# Altium schematic sheet 452006257#BDU控制板4-通讯接口.SchDoc
size A3; SheetNumber: 10; SheetTotal: 12
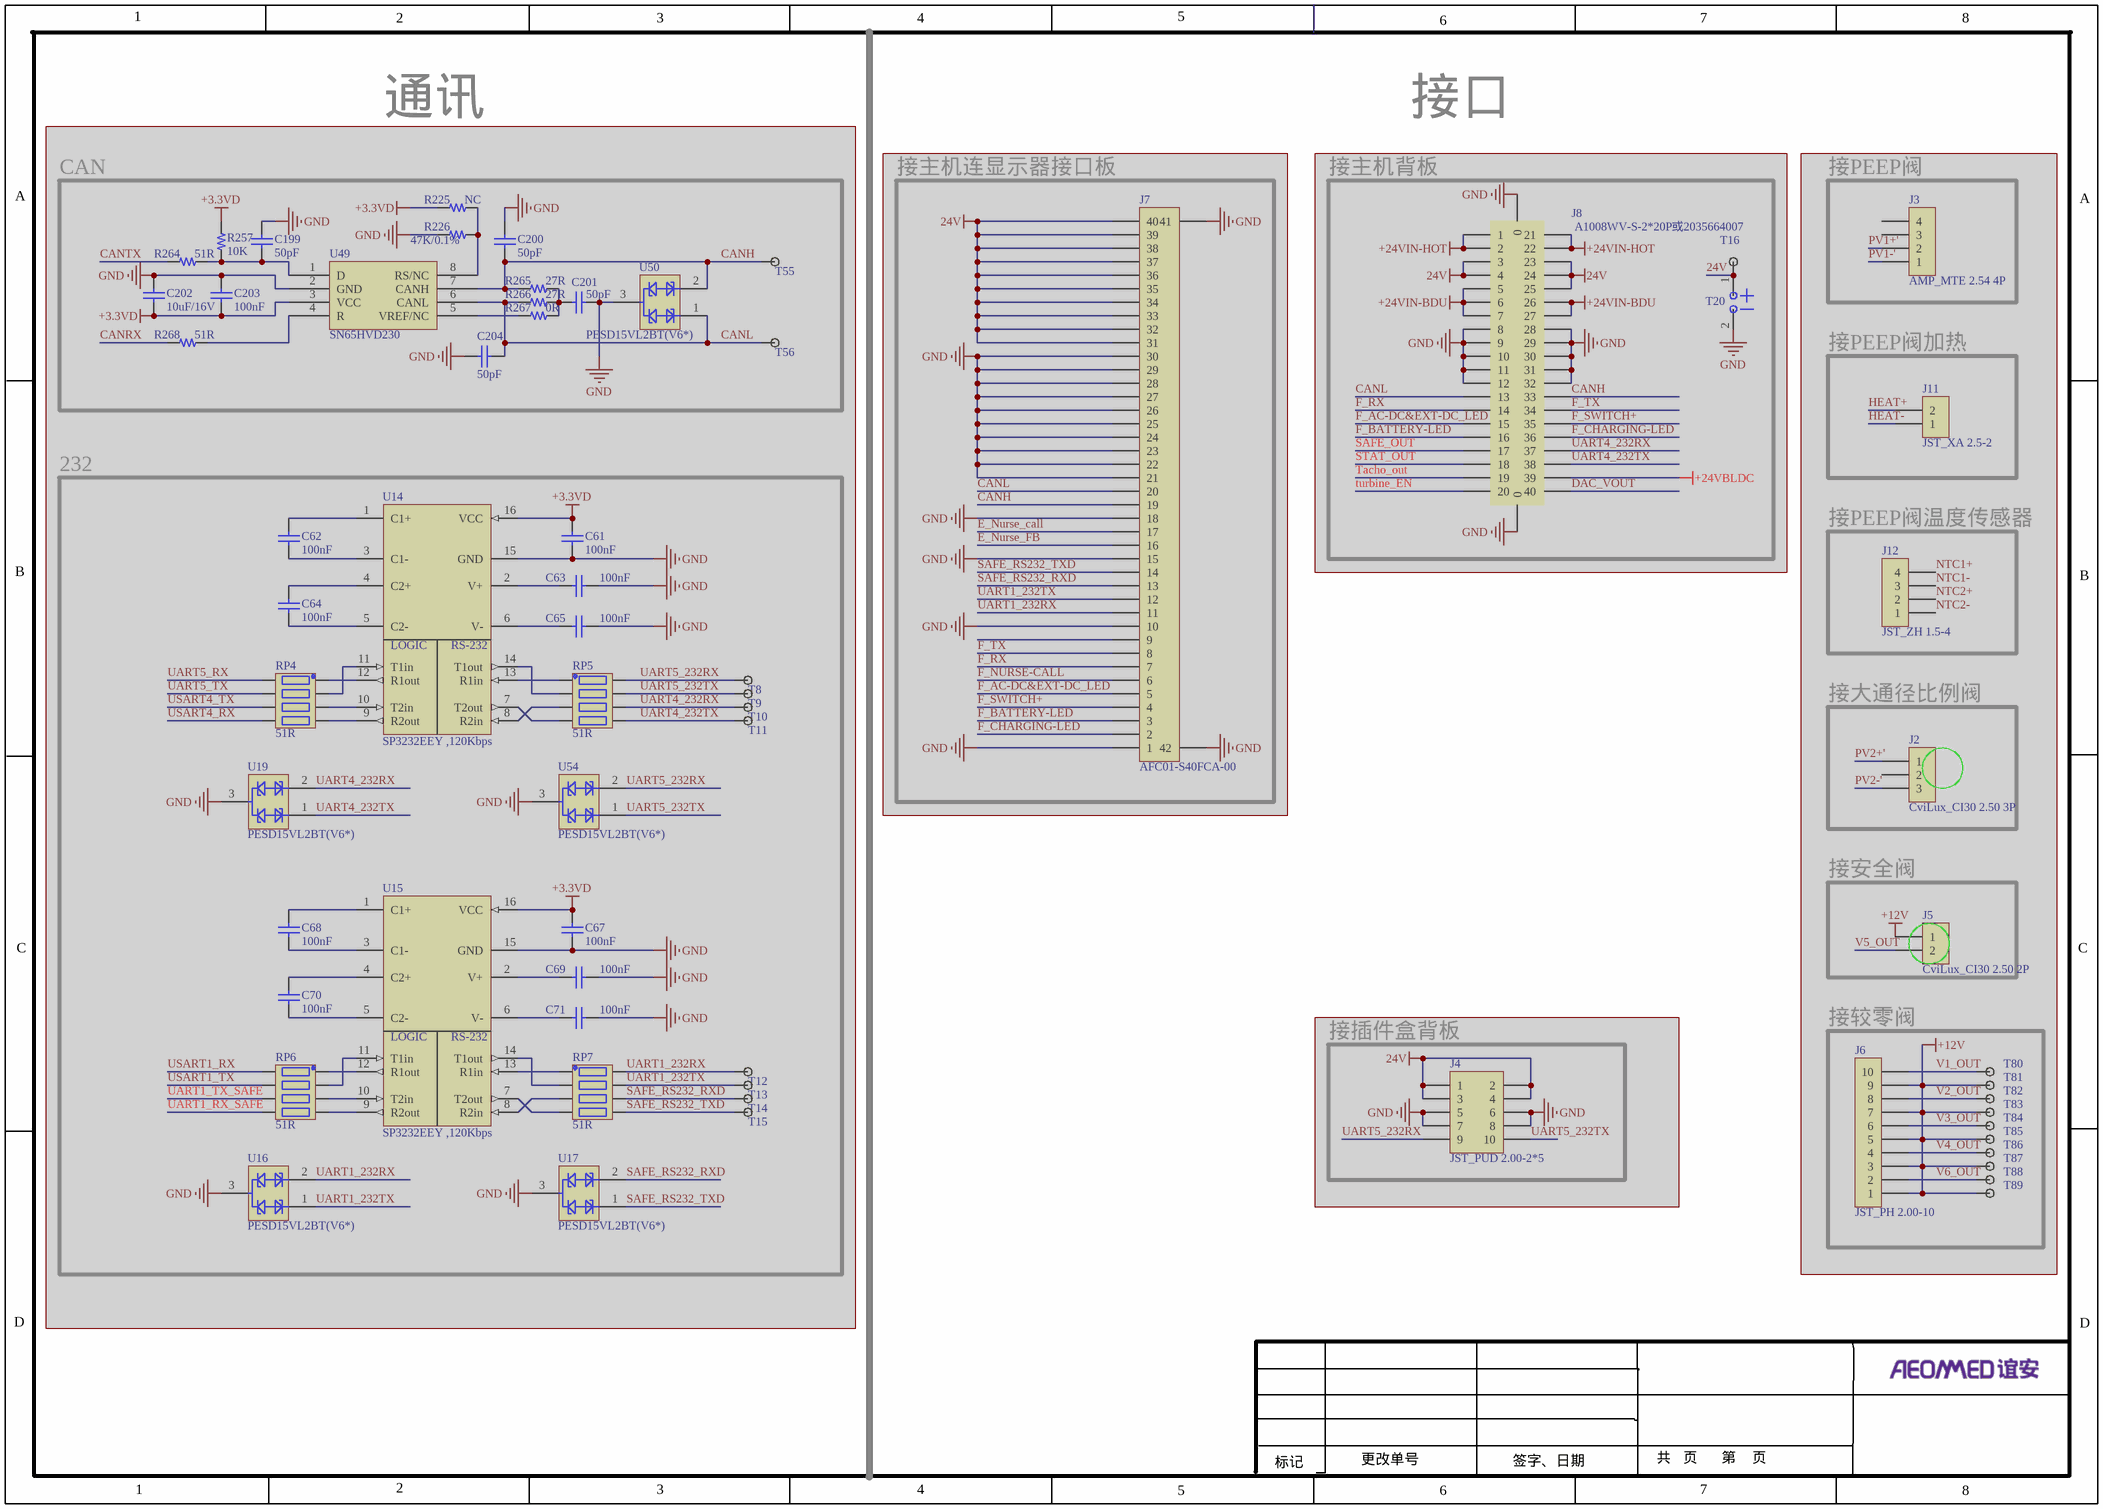
[diagram p0: 452006257#BDU控制板4-通讯接口.SchDoc]

## Parts
C61  100nF  [C-0603]  (masked out: inside a compile mask, not in the netlist)
C62  100nF  [C-0603]  (masked out: inside a compile mask, not in the netlist)
C63  100nF  [C-0603]  (masked out: inside a compile mask, not in the netlist)
C64  100nF  [C-0603]  (masked out: inside a compile mask, not in the netlist)
C65  100nF  [C-0603]  (masked out: inside a compile mask, not in the netlist)
C67  100nF  [C-0603]  (masked out: inside a compile mask, not in the netlist)
C68  100nF  [C-0603]  (masked out: inside a compile mask, not in the netlist)
C69  100nF  [C-0603]  (masked out: inside a compile mask, not in the netlist)
C70  100nF  [C-0603]  (masked out: inside a compile mask, not in the netlist)
C71  100nF  [C-0603]  (masked out: inside a compile mask, not in the netlist)
C199  50pF  [C-0603]  (masked out: inside a compile mask, not in the netlist)
C200  50pF  [C-0603]  (masked out: inside a compile mask, not in the netlist)
C201  50pF  [C-0603]  (masked out: inside a compile mask, not in the netlist)
C202  10uF/16V  [C-0805]  (masked out: inside a compile mask, not in the netlist)
C203  100nF  [C-0603]  (masked out: inside a compile mask, not in the netlist)
C204  50pF  [C-0603]  (masked out: inside a compile mask, not in the netlist)
J2  CviLux_CI30 2.50 3P  [CviLux_CI30 2.50 3P]  (masked out: inside a compile mask, not in the netlist)
J3  AMP_MTE 2.54 4P  [AMP_MTE 2.54 4P Side entry]  (masked out: inside a compile mask, not in the netlist)
J4  JST_PUD 2.00-2*5  [JST_PUD 2.00-2*5]  (masked out: inside a compile mask, not in the netlist)
J5  CviLux_CI30 2.50 2P  [CviLux_CI30 2.50 2P]  (masked out: inside a compile mask, not in the netlist)
J6  JST_PH 2.00-10  [JST_PH 2.00-10]  (masked out: inside a compile mask, not in the netlist)
J7  AFC01-S40FCA-00  [AFC01-S40FCA-00]  (masked out: inside a compile mask, not in the netlist)
J8  A1008WV-S-2*20P或2035664007  [A1008WR-S-2*20P]  (masked out: inside a compile mask, not in the netlist)
J11  JST_XA 2.5-2  [JST_XA 2.5-2 Side entry]  (masked out: inside a compile mask, not in the netlist)
J12  JST_ZH 1.5-4  [JST_ZH 1.5-4 Side entry]  (masked out: inside a compile mask, not in the netlist)
R225  NC  [R-0603]  (masked out: inside a compile mask, not in the netlist)
R226  47K/0.1%  [R-0603]  (masked out: inside a compile mask, not in the netlist)
R257  10K  [R-0603]  (masked out: inside a compile mask, not in the netlist)
R264  51R  [R-0603]  (masked out: inside a compile mask, not in the netlist)
R265  27R  [R-1206]  (masked out: inside a compile mask, not in the netlist)
R266  27R  [R-1206]  (masked out: inside a compile mask, not in the netlist)
R267  0R  [R-0603]  (masked out: inside a compile mask, not in the netlist)
R268  51R  [R-0603]  (masked out: inside a compile mask, not in the netlist)
RP4  51R  [RP-0603]  (masked out: inside a compile mask, not in the netlist)
RP5  51R  [RP-0603]  (masked out: inside a compile mask, not in the netlist)
RP6  51R  [RP-0603]  (masked out: inside a compile mask, not in the netlist)
RP7  51R  [RP-0603]  (masked out: inside a compile mask, not in the netlist)
T8  直插测试点  [DIPTP]  (value not drawn)  (masked out: inside a compile mask, not in the netlist)
T9  直插测试点  [DIPTP]  (value not drawn)  (masked out: inside a compile mask, not in the netlist)
T10  直插测试点  [DIPTP]  (value not drawn)  (masked out: inside a compile mask, not in the netlist)
T11  直插测试点  [DIPTP]  (value not drawn)  (masked out: inside a compile mask, not in the netlist)
T12  直插测试点  [DIPTP]  (value not drawn)  (masked out: inside a compile mask, not in the netlist)
T13  直插测试点  [DIPTP]  (value not drawn)  (masked out: inside a compile mask, not in the netlist)
T14  直插测试点  [DIPTP]  (value not drawn)  (masked out: inside a compile mask, not in the netlist)
T15  直插测试点  [DIPTP]  (value not drawn)  (masked out: inside a compile mask, not in the netlist)
T16  直插测试点  [DIPTP]  (value not drawn)  (masked out: inside a compile mask, not in the netlist)
T20  POWER_TEST  [BT]  (value not drawn)  (masked out: inside a compile mask, not in the netlist)
T55  直插测试点  [DIPTP]  (value not drawn)  (masked out: inside a compile mask, not in the netlist)
T56  直插测试点  [DIPTP]  (value not drawn)  (masked out: inside a compile mask, not in the netlist)
T80  直插测试点  [测试点1]  (value not drawn)  (masked out: inside a compile mask, not in the netlist)
T81  直插测试点  [测试点1]  (value not drawn)  (masked out: inside a compile mask, not in the netlist)
T82  直插测试点  [测试点1]  (value not drawn)  (masked out: inside a compile mask, not in the netlist)
T83  直插测试点  [测试点1]  (value not drawn)  (masked out: inside a compile mask, not in the netlist)
T84  直插测试点  [测试点1]  (value not drawn)  (masked out: inside a compile mask, not in the netlist)
T85  直插测试点  [测试点1]  (value not drawn)  (masked out: inside a compile mask, not in the netlist)
T86  直插测试点  [测试点1]  (value not drawn)  (masked out: inside a compile mask, not in the netlist)
T87  直插测试点  [测试点1]  (value not drawn)  (masked out: inside a compile mask, not in the netlist)
T88  直插测试点  [测试点1]  (value not drawn)  (masked out: inside a compile mask, not in the netlist)
T89  直插测试点  [测试点1]  (value not drawn)  (masked out: inside a compile mask, not in the netlist)
U14  SP3232EEY ,120Kbps  [TSSOP-16]  (masked out: inside a compile mask, not in the netlist)
U15  SP3232EEY ,120Kbps  [TSSOP-16]  (masked out: inside a compile mask, not in the netlist)
U16  PESD15VL2BT(V6*)  [SOT23-3]  (masked out: inside a compile mask, not in the netlist)
U17  PESD15VL2BT(V6*)  [SOT23-3]  (masked out: inside a compile mask, not in the netlist)
U19  PESD15VL2BT(V6*)  [SOT23-3]  (masked out: inside a compile mask, not in the netlist)
U49  SN65HVD230  [SOIC8]  (masked out: inside a compile mask, not in the netlist)
U50  PESD15VL2BT(V6*)  [SOT23-3]  (masked out: inside a compile mask, not in the netlist)
U54  PESD15VL2BT(V6*)  [SOT23-3]  (masked out: inside a compile mask, not in the netlist)

## Blocks framed on the sheet
CAN: C199-C204 R225 R226 R257 R264-R268 T55 T56 U49 U50
接主机连显示器接口板: J7
接主机背板: J8 T16 T20
接PEEP阀: J3
接PEEP阀加热: J11
232: C61-C65 C67-C71 RP4-RP7 T8-T15 U14-U17 U19 U54
接PEEP阀温度传感器: J12
接大通径比例阀: J2
接安全阀: J5
接较零阀: J6 T80-T89
接插件盒背板: J4

## Notes on the sheet
- 通讯
- 接口
- 1
- 2
- 3
- 4
- 5
- 6
- 7
- 8
- A
- B
- C
- D
- 更改单号
- 共   页      第    页
- 标记
- 签字、日期
- (in symbol SP3232EEY ,120Kbps) LOGIC; RS-232

## Library data of the parts
C61-C65 C67-C71 C199-C204 = C-0603: 物料编号: *; 物料名称: *; 厂家: *; 详细描述: *
J2 = CviLux_CI30 2.50 3P: 品牌：CviLux ，型号：CI30 03P 1 V K0，2.50间距，3P
J3 = AMP_MTE 2.54 4P: 品牌：AMP  型号：5-104450-3，2.54间距，4P; 名称: 插座4针，2.54间距; 制造商: AMP
J4 = JST_PUD 2.00-2*5: 品牌：JST 型号：B10B-PUDSS-1，直插，间距2.00，10pin
J5 = CviLux_CI30 2.50 2P: 品牌：CviLux ，型号：CI30 02 P 1 V K0，2.50间距，2P
J6 = JST_PH 2.00-10: 品牌：JST 型号：B2B-PH-K-S，直插，间距2.00，2pin
J7 = Header 30_1
J8 = A1008WV-S-2*20P
J12 = JST_ZH 1.5-4: 品牌：JST 型号：B4B-ZR，直插，间距1.5，4pin; 名称: 插座2针，2.0间距; 制造商: JST
R225 R226 R257 R264-R268 = 51Ω_1: 国巨RC0805FR-0751R; 物料编号: 210002130; 详细描述: 0805,1/8W,国巨RC0805FR-0751R; 制造商: 国巨; 版本: V1.00; 名称: 贴片电阻51±1%
RP4-RP7 = RP-0603
T8-T16 T55 T56 T80-T89 = Testpiont: 版本: V1.00; 名称: 直插测试点
U14 U15 = SP3232EEY ,120Kbps: 品牌：MaxLinear（迈凌）,型号：SP3232EEY,120Kbps,TSSOP-16, -40~+85°C,ROHS
U16 U17 U19 U50 U54 = PESD15VL2BT: 品牌：NXP，型号：PESD15VL2BT，SOT23-3，ROHS; 制造商: NXP; 名称: ESD保护PESD15VL2BT; 详细描述: NXP,PESD15VL2BT,SOT23-3,